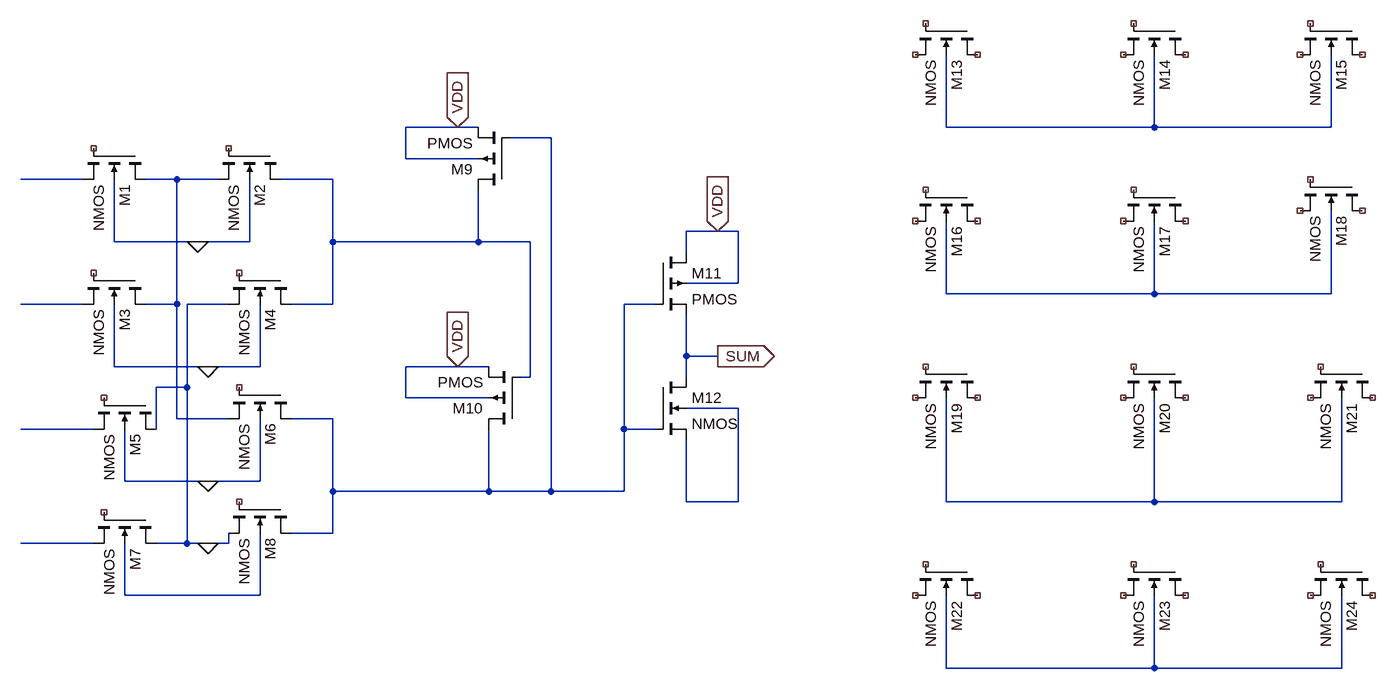
[diagram p0: schematic Draft7.asc]
Draft7.asc, the LTspice schematic file:
Version 4
SHEET 1 2104 856
WIRE 688 16 608 16
WIRE 720 16 688 16
WIRE 1440 16 1440 -96
WIRE 1760 16 1760 -96
WIRE 1760 16 1440 16
WIRE 2032 16 2032 -96
WIRE 2032 16 1760 16
WIRE 832 32 768 32
WIRE 608 64 608 16
WIRE 720 64 608 64
WIRE 112 96 16 96
WIRE 256 96 208 96
WIRE 320 96 256 96
WIRE 496 96 416 96
WIRE 1088 176 1040 176
WIRE 1120 176 1088 176
WIRE 160 192 160 96
WIRE 288 192 160 192
WIRE 368 192 368 96
WIRE 368 192 288 192
WIRE 496 192 496 96
WIRE 720 192 720 112
WIRE 720 192 496 192
WIRE 800 192 720 192
WIRE 1040 208 1040 176
WIRE 1120 256 1120 176
WIRE 1120 256 1040 256
WIRE 1440 272 1440 160
WIRE 1760 272 1760 160
WIRE 1760 272 1440 272
WIRE 2032 272 2032 144
WIRE 2032 272 1760 272
WIRE 112 288 16 288
WIRE 256 288 256 96
WIRE 256 288 208 288
WIRE 336 288 272 288
WIRE 496 288 496 192
WIRE 496 288 432 288
WIRE 992 288 944 288
WIRE 1040 368 1040 304
WIRE 1088 368 1040 368
WIRE 160 384 160 288
WIRE 304 384 160 384
WIRE 384 384 384 288
WIRE 384 384 304 384
WIRE 688 384 608 384
WIRE 736 384 688 384
WIRE 800 400 800 192
WIRE 800 400 784 400
WIRE 1040 400 1040 368
WIRE 272 416 272 288
WIRE 272 416 224 416
WIRE 608 432 608 384
WIRE 736 432 608 432
WIRE 1120 448 1040 448
WIRE 256 464 256 288
WIRE 336 464 256 464
WIRE 496 464 432 464
WIRE 128 480 16 480
WIRE 224 480 224 416
WIRE 944 480 944 288
WIRE 992 480 944 480
WIRE 176 560 176 480
WIRE 304 560 176 560
WIRE 384 560 384 464
WIRE 384 560 304 560
WIRE 496 576 496 464
WIRE 736 576 736 480
WIRE 736 576 496 576
WIRE 832 576 832 32
WIRE 832 576 736 576
WIRE 944 576 944 480
WIRE 944 576 832 576
WIRE 1040 592 1040 496
WIRE 1120 592 1120 448
WIRE 1120 592 1040 592
WIRE 1440 592 1440 432
WIRE 1760 592 1760 432
WIRE 1760 592 1440 592
WIRE 2048 592 2048 432
WIRE 2048 592 1760 592
WIRE 496 640 496 576
WIRE 496 640 432 640
WIRE 128 656 16 656
WIRE 272 656 272 416
WIRE 272 656 224 656
WIRE 304 656 272 656
WIRE 336 656 336 640
WIRE 336 656 304 656
WIRE 176 736 176 656
WIRE 384 736 384 640
WIRE 384 736 176 736
WIRE 1440 848 1440 736
WIRE 1760 848 1760 736
WIRE 1760 848 1440 848
WIRE 2048 848 2048 736
WIRE 2048 848 1760 848
FLAG 1088 368 SUM
IOPIN 1088 368 Out
FLAG 1088 176 VDD
IOPIN 1088 176 In
FLAG 688 384 VDD
IOPIN 688 384 In
FLAG 688 16 VDD
IOPIN 688 16 In
FLAG 288 192 0
FLAG 304 384 0
FLAG 304 560 0
FLAG 304 656 0
SYMBOL nmos4 208 48 R90
SYMATTR InstName M1
SYMBOL nmos4 416 48 R90
SYMATTR InstName M2
SYMBOL nmos4 208 240 R90
SYMATTR InstName M3
SYMBOL nmos4 432 240 R90
SYMATTR InstName M4
SYMBOL nmos4 224 432 R90
SYMATTR InstName M5
SYMBOL nmos4 432 416 R90
SYMATTR InstName M6
SYMBOL nmos4 224 608 R90
SYMATTR InstName M7
SYMBOL nmos4 432 592 R90
SYMATTR InstName M8
SYMBOL pmos4 768 112 R180
SYMATTR InstName M9
SYMBOL pmos4 784 480 R180
SYMATTR InstName M10
SYMBOL pmos4 992 208 R0
SYMATTR InstName M11
SYMBOL nmos4 992 400 R0
SYMATTR InstName M12
SYMBOL nmos4 1488 -144 R90
SYMATTR InstName M13
SYMBOL nmos4 1808 -144 R90
SYMATTR InstName M14
SYMBOL nmos4 2080 -144 R90
SYMATTR InstName M15
SYMBOL nmos4 1488 112 R90
SYMATTR InstName M16
SYMBOL nmos4 1808 112 R90
SYMATTR InstName M17
SYMBOL nmos4 2080 96 R90
SYMATTR InstName M18
SYMBOL nmos4 1488 384 R90
SYMATTR InstName M19
SYMBOL nmos4 1808 384 R90
SYMATTR InstName M20
SYMBOL nmos4 2096 384 R90
SYMATTR InstName M21
SYMBOL nmos4 1488 688 R90
SYMATTR InstName M22
SYMBOL nmos4 1808 688 R90
SYMATTR InstName M23
SYMBOL nmos4 2096 688 R90
SYMATTR InstName M24

The netlist it stands for:
* Draft7.asc
M1 N004 NC_01 N003 0 NMOS
M2 N005 NC_02 N004 0 NMOS
M3 N004 NC_03 N007 0 NMOS
M4 N005 NC_04 0 0 NMOS
M5 0 NC_05 N009 0 NMOS
M6 N002 NC_06 N004 0 NMOS
M7 0 NC_07 N011 N012 NMOS
M8 N002 NC_08 0 N012 NMOS
M9 N005 N002 VDD VDD PMOS
M10 N002 N005 VDD VDD PMOS
M11 VDD N002 SUM VDD PMOS
M12 SUM N002 N008 N008 NMOS
M13 NC_09 NC_10 NC_11 N001 NMOS
M14 NC_12 NC_13 NC_14 N001 NMOS
M15 NC_15 NC_16 NC_17 N001 NMOS
M16 NC_18 NC_19 NC_20 N006 NMOS
M17 NC_21 NC_22 NC_23 N006 NMOS
M18 NC_24 NC_25 NC_26 N006 NMOS
M19 NC_27 NC_28 NC_29 N010 NMOS
M20 NC_30 NC_31 NC_32 N010 NMOS
M21 NC_33 NC_34 NC_35 N010 NMOS
M22 NC_36 NC_37 NC_38 N013 NMOS
M23 NC_39 NC_40 NC_41 N013 NMOS
M24 NC_42 NC_43 NC_44 N013 NMOS
.model NMOS NMOS
.model PMOS PMOS
.lib standard.mos
.backanno
.end